# EAGLE schematic AD2 Dynamic Characteristic Addon (EAGLE 7.7.0)
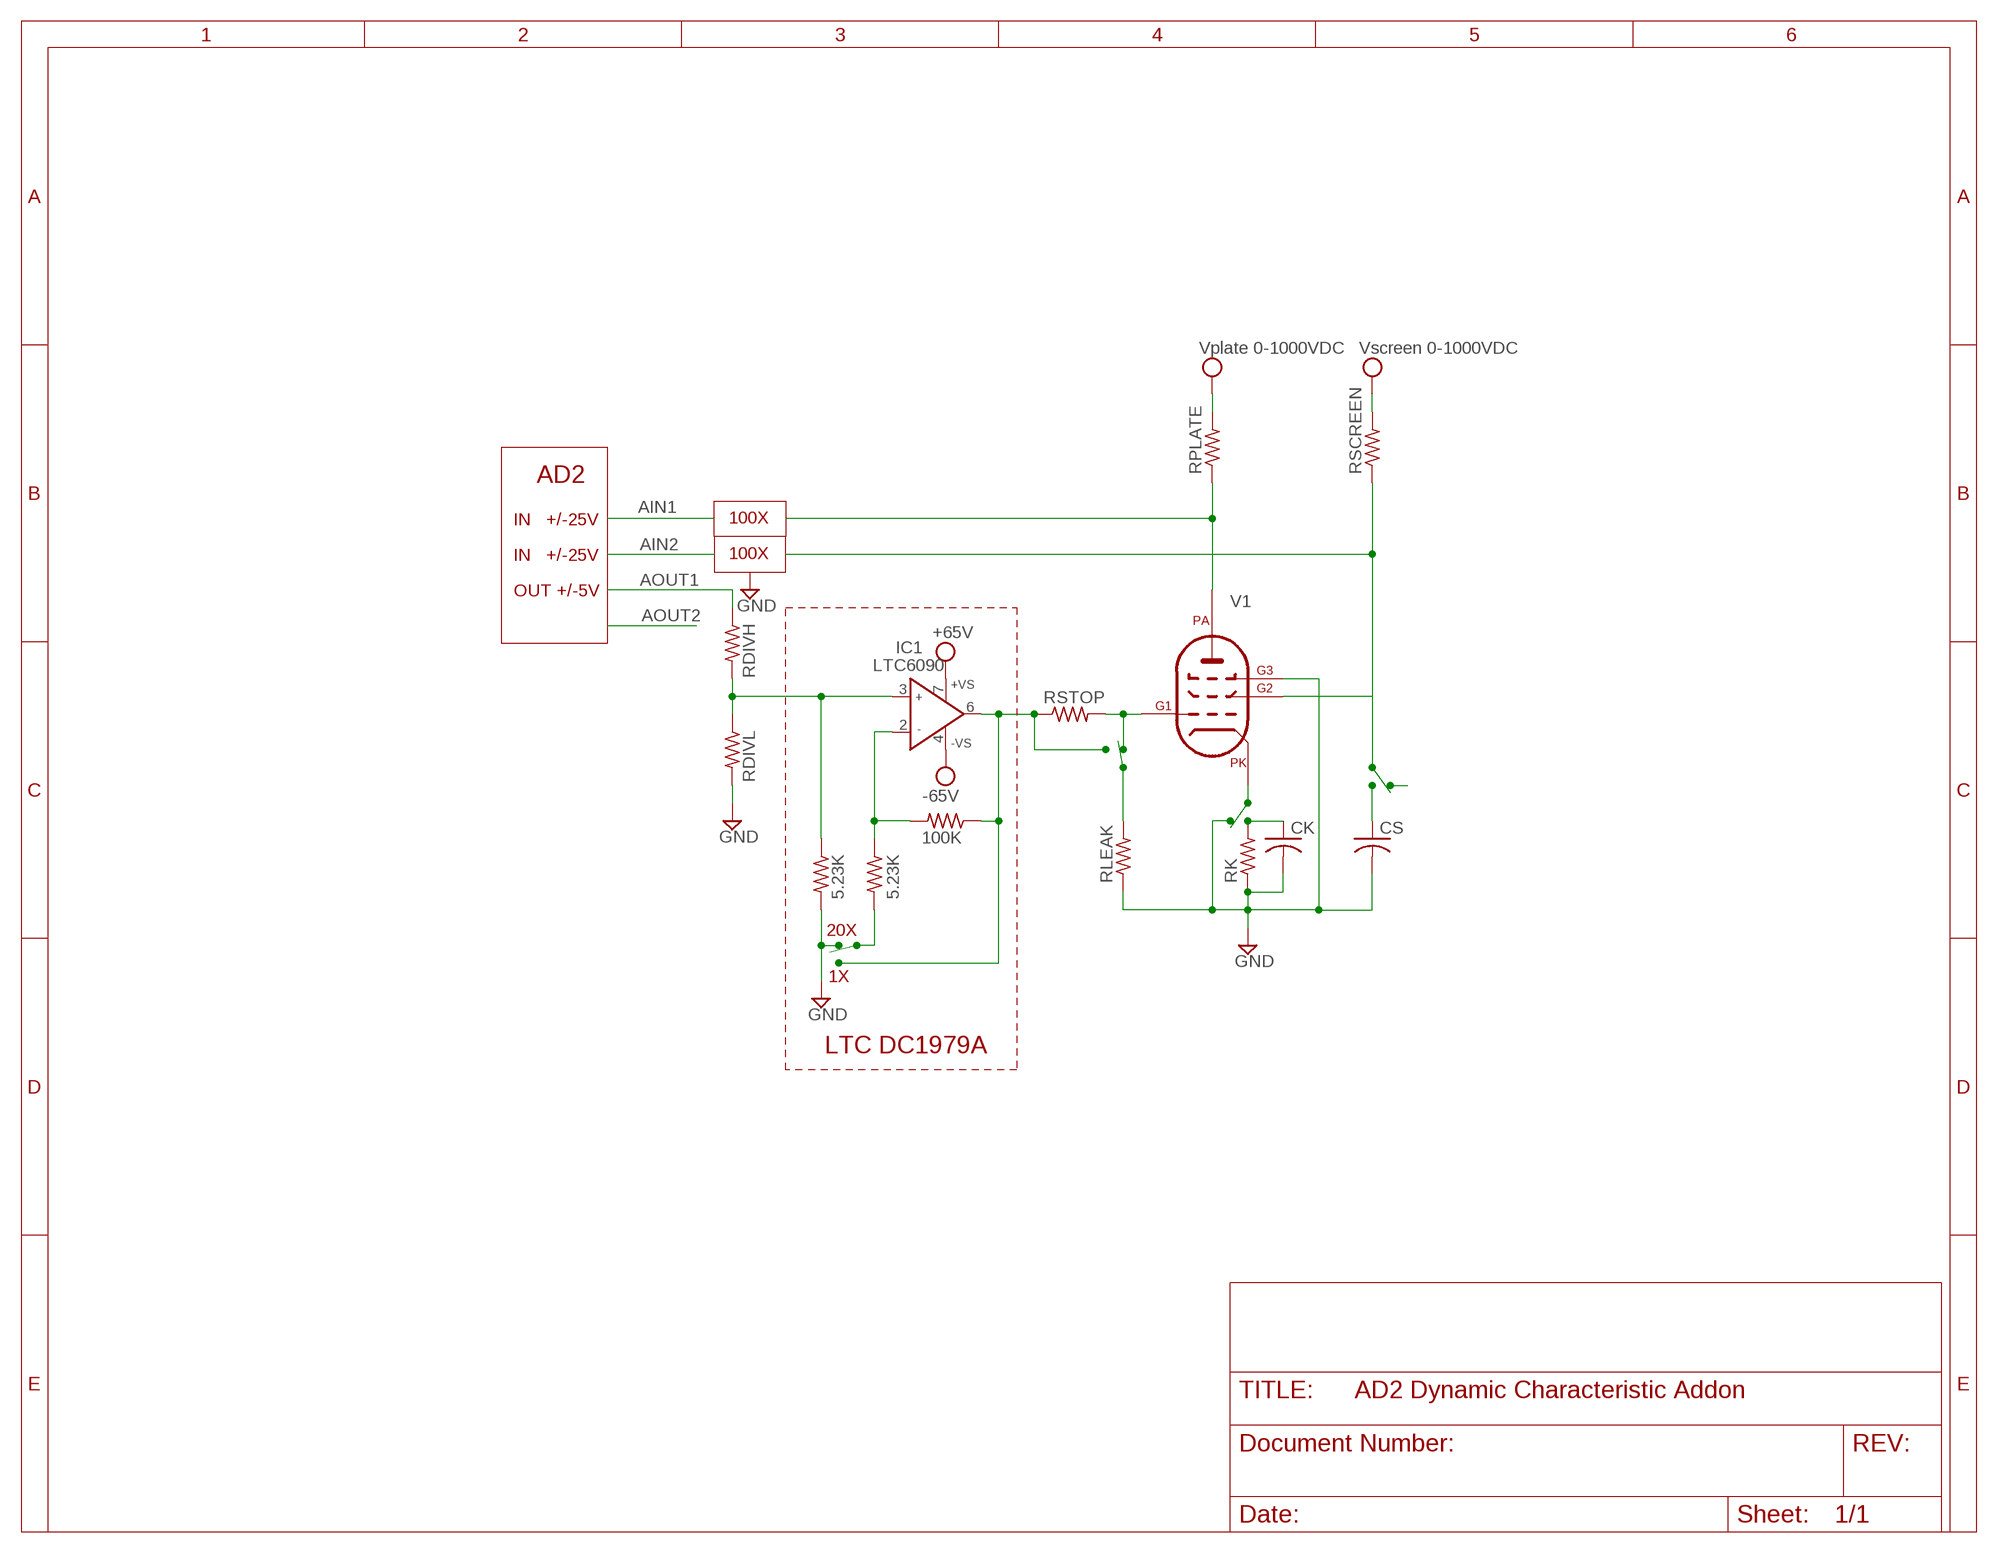
[diagram p0: schematic, sheet 1]

## Parts
CK  C-US025-040X050  [C025-040X050]
CS  C-US025-040X050  [C025-040X050]
IC1  LTC6090  AD820R  [SO8]
R1  RDIVL  R-US_R0603  [R0603]
R2  RDIVH  R-US_R0603  [R0603]
R3  100K  R-US_R0603  [R0603]
R4  5.23K  R-US_R0603  [R0603]
R5  5.23K  R-US_R0603  [R0603]
RK  R-US_R0603  [R0603]
RLEAK  R-US_R0603  [R0603]
RPLATE  R-US_R0603  [R0603]
RSCREEN  R-US_R0603  [R0603]
RSTOP  R-US_R0603  [R0603]

## Nets
AIN1: RPLATE.1
AIN2: RSCREEN.1
AOUT1: IC1.3(IN+) R1.1 R2.2 R5.1
GND: CK.2 CS.2 R1.2 R5.2 RK.1 RLEAK.1
N$2: IC1.2(IN-) R3.2 R4.1
N$3: IC1.6(OUT) R3.1 RSTOP.1
N$4: RSTOP.2
N$6: R2.1
N$7: R4.2
N$8: RLEAK.2
N$9: CK.1 RK.2
N$11: CS.1
VCC: IC1.4(-VS) IC1.7(+VS) RPLATE.2 RSCREEN.2 ; supply symbol labelled +65V, -65V, Vplate 0-1000VDC, Vscreen 0-1000VDC

## Notes on the sheet
- AD2
- IN   +/-25V | 100X
- IN   +/-25V | 100X
- OUT +/-5V
- 20X
- 1X
- LTC DC1979A

## Library data of the parts
CK CS = rcl:C-US: CAPACITOR, American symbol
IC1 = analog-devices:AD820: Single-Supply, Rail-to-Rail, Low Power, FET Input Op Amp Source: http://www.analog.com/static/imported-files/data_sheets/AD820.pdf; OC_FARNELL: 1838867; OC_NEWARK: unknown
R1-R5 RK RLEAK RPLATE RSCREEN RSTOP = rcl:R-US_: RESISTOR, American symbol